# Altium schematic sheet config-bank8.SchDoc: Config FPGA - Bank 8
size Letter; CheckedBy: E. Chiu; CompanyName: Brinton Engineering, LLC; DrawnBy: J. Brinton; Engineer: J. Brinton; Address1: 3479 Edison Way; Address2: Menlo Park CA 94025; Address3: +1 (877) 778-8435; Address4: brintonengineering.com; Revision: 1; SheetNumber: 25; SheetTotal: 71
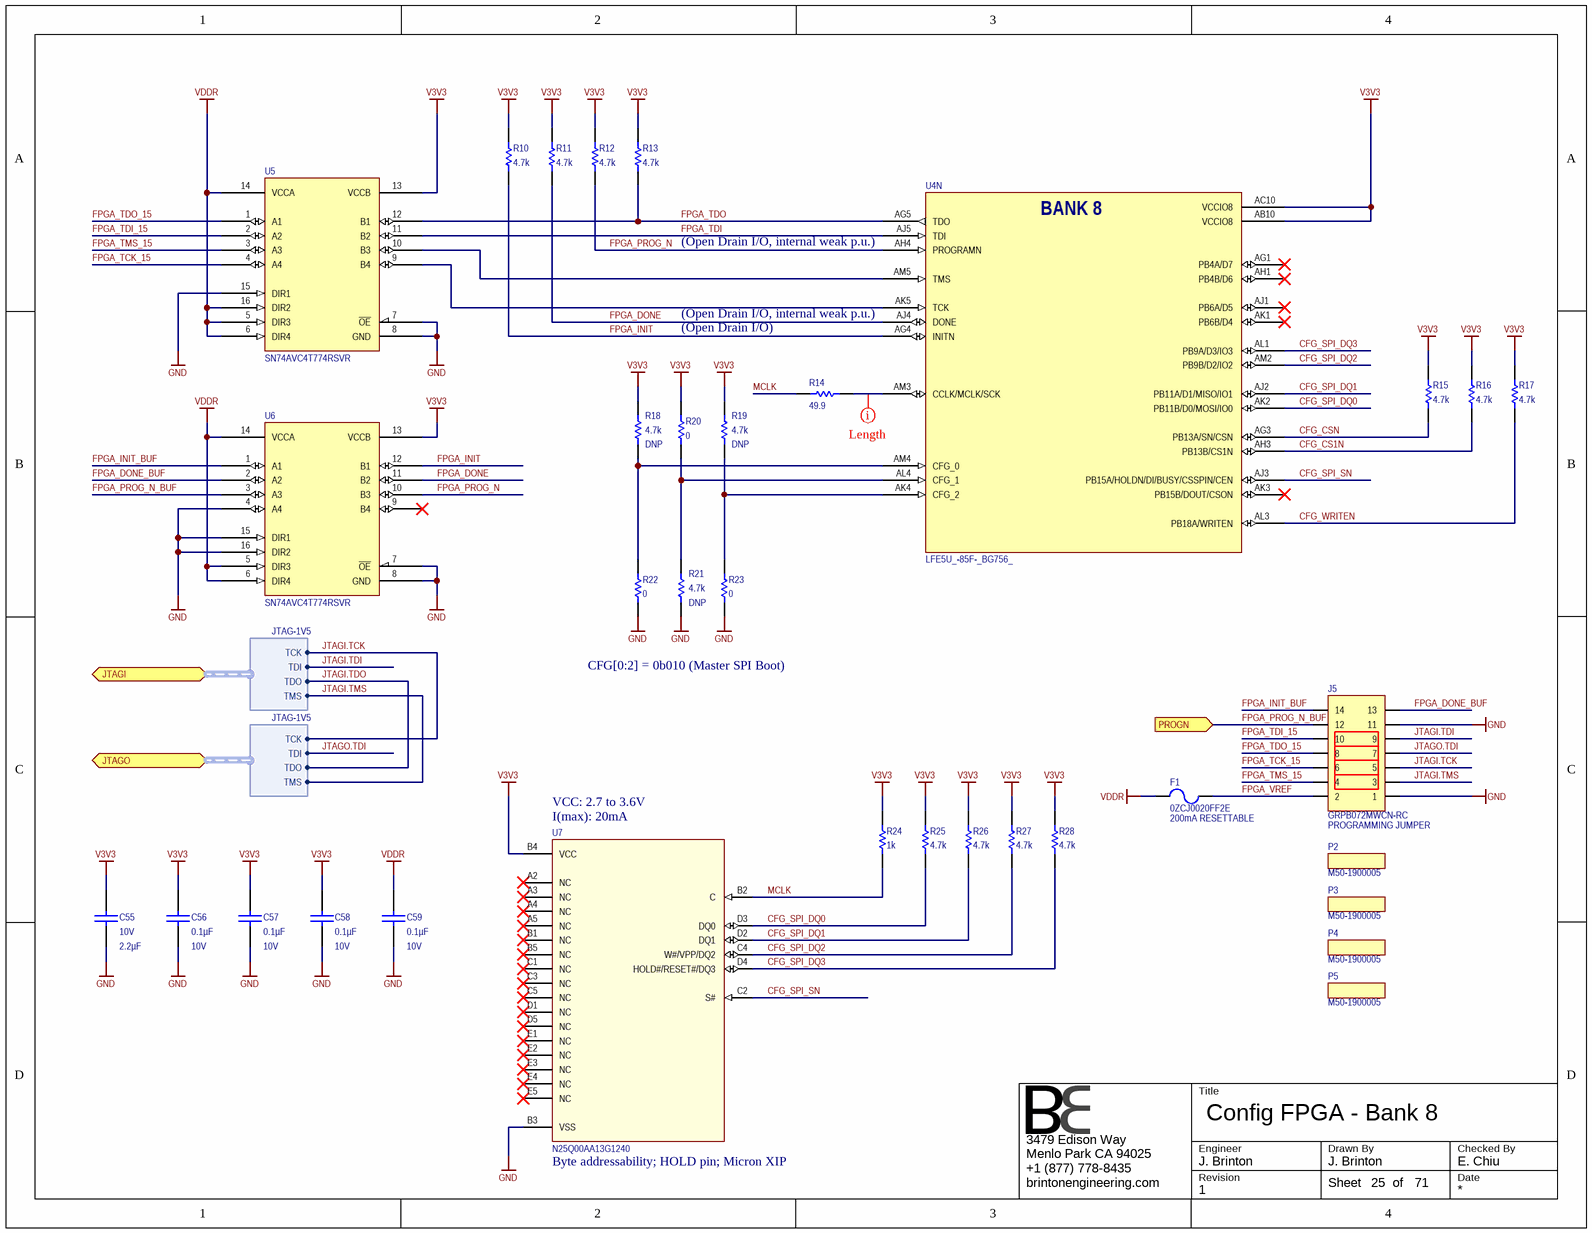
[diagram p0: config-bank8.SchDoc]

## Parts
C55  Voltage - Rated: 10V  Capacitance: 2.2µF  [CAPC1608X90N]  (hidden comment: GRM188R71A225KE15D)
C56  Capacitance: 0.1µF  Voltage - Rated: 10V  [CAPC1005X56N]  (hidden comment: GRM155R71A104KA01J)
C57  Capacitance: 0.1µF  Voltage - Rated: 10V  [CAPC1005X56N]  (hidden comment: GRM155R71A104KA01J)
C58  Capacitance: 0.1µF  Voltage - Rated: 10V  [CAPC1005X56N]  (hidden comment: GRM155R71A104KA01J)
C59  Capacitance: 0.1µF  Voltage - Rated: 10V  [CAPC1005X56N]  (hidden comment: GRM155R71A104KA01J)
F1  0ZCJ0020FF2E  [1206]
J5  GRPB072MWCN-RC  [GRPB072MWCN-RC]
P2  M50-1900005  (mechanical)
P3  M50-1900005  (mechanical)
P4  M50-1900005  (mechanical)
P5  M50-1900005  (mechanical)
R10  value 4.7k  [0603]  (hidden comment: RES 0603 4.7k 1%)
R11  value 4.7k  [0603]  (hidden comment: RES 0603 4.7k 1%)
R12  value 4.7k  [0603]  (hidden comment: RES 0603 4.7k 1%)
R13  value 4.7k  [0603]  (hidden comment: RES 0603 4.7k 1%)
R14  value 49.9  [0603]  (hidden comment: RES 0603 49.9 1%)
R15  value 4.7k  [0603]  (hidden comment: RES 0603 4.7k 1%)
R16  value 4.7k  [0603]  (hidden comment: RES 0603 4.7k 1%)
R17  value 4.7k  [0603]  (hidden comment: RES 0603 4.7k 1%)
R18  value 4.7k  Do Not Place: DNP  [0603]  (hidden comment: RES 0603 4.7k 1%)
R19  value 4.7k  Do Not Place: DNP  [0603]  (hidden comment: RES 0603 4.7k 1%)
R20  value 0  [0603]  (hidden comment: RES 0603 0)
R21  value 4.7k  Do Not Place: DNP  [0603]  (hidden comment: RES 0603 4.7k 1%)
R22  value 0  [0603]  (hidden comment: RES 0603 0)
R23  value 0  [0603]  (hidden comment: RES 0603 0)
R24  value 1k  [0603]  (hidden comment: RES 0603 1k 1%)
R25  value 4.7k  [0603]  (hidden comment: RES 0603 4.7k 1%)
R26  value 4.7k  [0603]  (hidden comment: RES 0603 4.7k 1%)
R27  value 4.7k  [0603]  (hidden comment: RES 0603 4.7k 1%)
R28  value 4.7k  [0603]  (hidden comment: RES 0603 4.7k 1%)
U4  LFE5U_-85F-_BG756_  [caBGA756]  (part N of 19)
U5  SN74AVC4T774RSVR  [RSV]
U6  SN74AVC4T774RSVR  [RSV]
U7  N25Q00AA13G1240  [L-PBGA-24]

## Ports
JTAGI (harness JTAG-1V5), JTAGO (harness JTAG-1V5), PROGN (in)

## Harnesses
JTAG-1V5: TMS, TCK, TDI, TDO

## Nets
GND: C55.1 C56.1 C57.1 C58.1 C59.1 J5.1 J5.11 R21.1 R22.1 R23.1 U5.7(~{OE}) U5.8(GND) U5.15(DIR1) U6.4(A4) U6.7(~{OE}) U6.8(GND) U6.15(DIR1) U6.16(DIR2) U7.B3(VSS)
V3V3: C55.2 C56.2 C57.2 C58.2 R10.2 R11.2 R12.2 R13.2 R15.2 R16.2 R17.2 R18.2 R19.2 R20.2 R24.2 R25.2 R26.2 R27.2 R28.2 U4.AB10(VCCIO8) U4.AC10(VCCIO8) U5.13(VCCB) U6.13(VCCB) U7.B4(VCC)
VDDR: C59.2 F1.1 U5.5(DIR3) U5.6(DIR4) U5.14(VCCA) U5.16(DIR2) U6.5(DIR3) U6.6(DIR4) U6.14(VCCA)
CFG_CS1N: R16.1 U4.AH3(PB13B/CS1N)
CFG_CSN: R15.1 U4.AG3(PB13A/SN/CSN)
CFG_SPI_DQ0: R25.1 U4.AK2(PB11B/D0/MOSI/IO0) U7.D3(DQ0)
CFG_SPI_DQ1: R26.1 U4.AJ2(PB11A/D1/MISO/IO1) U7.D2(DQ1)
CFG_SPI_DQ2: R27.1 U4.AM2(PB9B/D2/IO2) U7.C4(W#/VPP/DQ2)
CFG_SPI_DQ3: R28.1 U4.AL1(PB9A/D3/IO3) U7.D4(HOLD#/RESET#/DQ3)
CFG_SPI_SN: U4.AJ3(PB15A/HOLDN/DI/BUSY/CSSPIN/CEN) U7.C2(S#)
CFG_WRITEN: R17.1 U4.AL3(PB18A/WRITEN)
FPGA_DONE: R11.1 U4.AJ4(DONE) U6.11(B2)
FPGA_DONE_BUF: J5.13 U6.2(A2)
FPGA_INIT: R10.1 U4.AG4(INITN) U6.12(B1)
FPGA_INIT_BUF: J5.14 U6.1(A1)
FPGA_PROG_N: R12.1 U4.AH4(PROGRAMN) U6.10(B3)
FPGA_PROG_N_BUF: J5.12 U6.3(A3) ; port PROGN
FPGA_TCK_15: J5.6 U5.4(A4)
FPGA_TDI: U4.AJ5(TDI) U5.11(B2)
FPGA_TDI_15: J5.10 U5.2(A2)
FPGA_TDO: R13.1 U4.AG5(TDO) U5.12(B1)
FPGA_TDO_15: J5.8 U5.1(A1)
FPGA_TMS_15: J5.4 U5.3(A3)
FPGA_VREF: F1.2 J5.2
JTAGI.TCK: J5.5 ; port JTAGI.TCK, port JTAGO.TCK
JTAGI.TDI: J5.9 ; port JTAGI.TDI
JTAGI.TDO: port JTAGI.TDO, port JTAGO.TDO
JTAGI.TMS: J5.3 ; port JTAGI.TMS, port JTAGO.TMS
JTAGO.TDI: J5.7 ; port JTAGO.TDI
MCLK: R14.2 R24.1 U7.B2(C)
NetR14_1: R14.1 U4.AM3(CCLK/MCLK/SCK)
NetR18_1: R18.1 R22.2 U4.AM4(CFG_0)
NetR19_1: R19.1 R23.2 U4.AK4(CFG_2)
NetR20_1: R20.1 R21.2 U4.AL4(CFG_1)
NetU4_AK5: U4.AK5(TCK) U5.9(B4)
NetU4_AM5: U4.AM5(TMS) U5.10(B3)

Not connected (* = marked no-connect by the designer): U4 AG1(PB4A/D7)* AH1(PB4B/D6)* AJ1(PB6A/D5)* AK1(PB6B/D4)* AK3(PB15B/DOUT/CSON)*; U6 9(B4)*; U7 A2(NC)* A3(NC)* A4(NC)* A5(NC)* B1(NC)* B5(NC)* C1(NC)* C3(NC)* C5(NC)* D1(NC)* D5(NC)* E1(NC)* E2(NC)* E3(NC)* E4(NC)* E5(NC)*

## Layout directives
rule Length Constraint [Min Length = 0mil    Max Length = 2000mil]: NetR14_1

## Notes on the sheet
- (near U4) (Open Drain I/O, internal weak p.u.)
- (Open Drain I/O)
- CFG[0:2] = 0b010 (Master SPI Boot)
- (near U7) VCC: 2.7 to 3.6V
- (near U7) I(max): 20mA
- (near F1) 200mA RESETTABLE
- PROGRAMMING JUMPER
- (near U7) Byte addressability; HOLD pin; Micron XIP
- Title
- Engineer
- Revision
- Drawn By
- Checked By
- Date
- Sheet
- of
- (in symbol LFE5U_-85F-_BG756_, part N) BANK 8

## Library data of the parts
C55 = GRM188R71A225KE15D: CAP CER 2.2UF 10V 10% X7R 0603; Manufacturer: Murata Electronics North America; Manufacturer P/N: GRM188R71A225KE15D; Operating Temperature: -55°C ~ 125°C; Thickness (Max): 0.035" (0.90mm); Tolerance: ±10%; Package / Case: 0603 (1608 Metric); Temperature Coefficient: X7R; Supplier 1: Newark; Supplier 2: Digi-Key; RoHS: RoHS Compliant; Size / Dimension: 0.063" L x 0.031" W (1.60mm x 0.80mm); Mounting Type: Surface Mount, MLCC; ComponentLink1URL: http://www.murata.com/~/media/webrenewal/support/library/catalog/products/capacitor/mlcc/c02e.ashx; ComponentLink1Description: http://www.murata.com/~/media/webrenewal/support/library/catalog/products/capacitor/mlcc/c02e.ashx; Supplier Part Number 1: 72R4209; Supplier Part Number 2: 490-4520-1-ND
C56-C59 = GRM155R71A104KA01J: CAP CER 0.1UF 10V 10% X7R 0402; Manufacturer: Murata Electronics North America; Manufacturer P/N: GRM155R71A104KA01J; Operating Temperature: -55°C ~ 125°C; Thickness (Max): 0.022" (0.55mm); Size / Dimension: 0.039" L x 0.020" W (1.00mm x 0.50mm); RoHS: RoHS Compliant; Mounting Type: Surface Mount, MLCC; Supplier 1: Digi-Key; ComponentLink1URL: http://www.murata.com/~/media/webrenewal/support/library/catalog/products/capacitor/mlcc/c02e.ashx; ComponentLink1Description: http://www.murata.com/~/media/webrenewal/support/library/catalog/products/capacitor/mlcc/c02e.ashx; Supplier Part Number 1: 490-6322-1-ND; Temperature Coefficient: X7R; Package / Case: 0402 (1005 Metric); Tolerance: ±10%
F1 = 0ZCJ0020FF2E: PTC Resettable Fuse, 0.2A, 30V, SMD 1206; Manufacturer: Bell Fuse; Manufacturer P/N: 0ZCJ0020FF2E
J5 = GRPB072MWCN-RC: Male Header, 0.050" Pitch, Right Angle, 2x7 Position; Manufacturer: Sullins; Manufacturer P/N: GRPB072MWCN-RC
P2-P5 = M50-1900005: 1.27mm Jumper Socket; Manufacturer: Harwin; Manufacturer P/N: M50-1900005
R10-R13 R15-R19 R21 R25-R28 = RES 0603 10k 1%: Thick Film Resistor 4.7k Ohms +/-1% 0.1W 75V SMD 0603; Manufacturer: Panasonic - ECG; Manufacturer P/N: ERJ3EKF4701V; Tcr: +/-100; Tr: -55:+155; Tolerance: +/-1%; Alternatives: *; Voltage: 75V; Power: 0.1W; P/N: ERJ3EKF4701V
R14 = RES 0603 10k 1%: Thick Film Resistor 49.9 Ohms +/-1% 0.1W 75V SMD 0603; Manufacturer: Panasonic - ECG; Manufacturer P/N: ERJ-3EKF49R9V; Tcr: +/-100; Tr: -55:+155; Tolerance: +/-1%; Alternatives: *; Voltage: 75V; Power: 0.1W; P/N: ERJ-3EKF49R9V
R20 R22 R23 = RES 0603 10k 1%: Thick Film Resistor 0 Ohms SMD 0603; Manufacturer: Panasonic - ECG; Manufacturer P/N: ERJ-3GEY0R00V; Tcr: +/-100; Tolerance: +/-1%; Tr: -55:+155; Voltage: 75V; Power: 0.1W; Alternatives: *; P/N: ERJ-3GEY0R00V
R24 = RES 0603 10k 1%: Thick Film Resistor 1k Ohms +/-1% 0.1W 75V SMD 0603; Manufacturer: Panasonic - ECG; Manufacturer P/N: ERJ3EKF1001V; Tcr: +/-100; Tr: -55:+155; Tolerance: +/-1%; Alternatives: *; Voltage: 75V; Power: 0.1W; P/N: ERJ3EKF1001V
U4 = LFE5U_-85F-_BG756_: ECP5 FPGA, 85k LUT, 756-caBGA; Manufacturer: Lattice Semiconductor; Manufacturer P/N: LFE5U_-85F-_BG756_
U5 U6 = SN74AVC4T774RSVR: 4-Bit Dual-Supply Bus Transceiver; Manufacturer: Texas Instruments; Manufacturer P/N: SN74AVC4T774RSVR
U7 = N25Q00AA13G1240: 1024Mb, 3.3V Serial Flash Memory LBGA24; Manufacturer: Micron; Manufacturer P/N: N25Q00AA13G1240; Temperature: -40:85